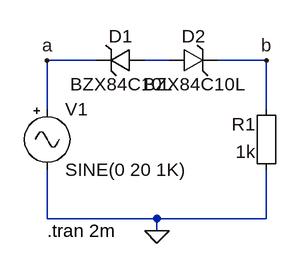
[diagram p0: schematic clipper_series_bipolar.asc]
clipper_series_bipolar.asc, the LTspice schematic file:
Version 4
SHEET 1 880 680
WIRE -32 112 -96 112
WIRE 64 112 32 112
WIRE 192 112 128 112
WIRE -96 176 -96 112
WIRE 192 176 192 112
WIRE -96 320 -96 256
WIRE 48 320 -96 320
WIRE 192 320 192 256
WIRE 192 320 48 320
WIRE 48 336 48 320
FLAG -96 112 a
FLAG 192 112 b
FLAG 48 336 0
SYMBOL zener 32 96 R90
WINDOW 0 0 32 VBottom 2
WINDOW 3 32 32 VTop 2
SYMATTR InstName D1
SYMATTR Value BZX84C10L
SYMATTR Description Diode
SYMATTR Type diode
SYMBOL Misc\\EuropeanResistor 208 272 R180
WINDOW 0 31 76 Left 2
WINDOW 3 31 40 Left 2
SYMATTR InstName R1
SYMATTR Value 1k
SYMBOL zener 64 128 R270
WINDOW 0 32 32 VTop 2
WINDOW 3 0 32 VBottom 2
SYMATTR InstName D2
SYMATTR Value BZX84C10L
SYMATTR Description Diode
SYMATTR Type diode
SYMBOL Misc\\signal -96 160 R0
SYMATTR InstName V1
SYMATTR Value SINE(0 20 1K)
TEXT -96 336 Left 2 !.tran 2m

The netlist it stands for:
* clipper_series_bipolar.asc
D1 N001 a BZX84C10L
R1 0 b 1k
D2 N001 b BZX84C10L
V1 a 0 SINE(0 20 1K)
.model D D
.lib standard.dio
.tran 2m
.backanno
.end